# EAGLE design TSOC_Teensy3X (EAGLE 6.6.0)
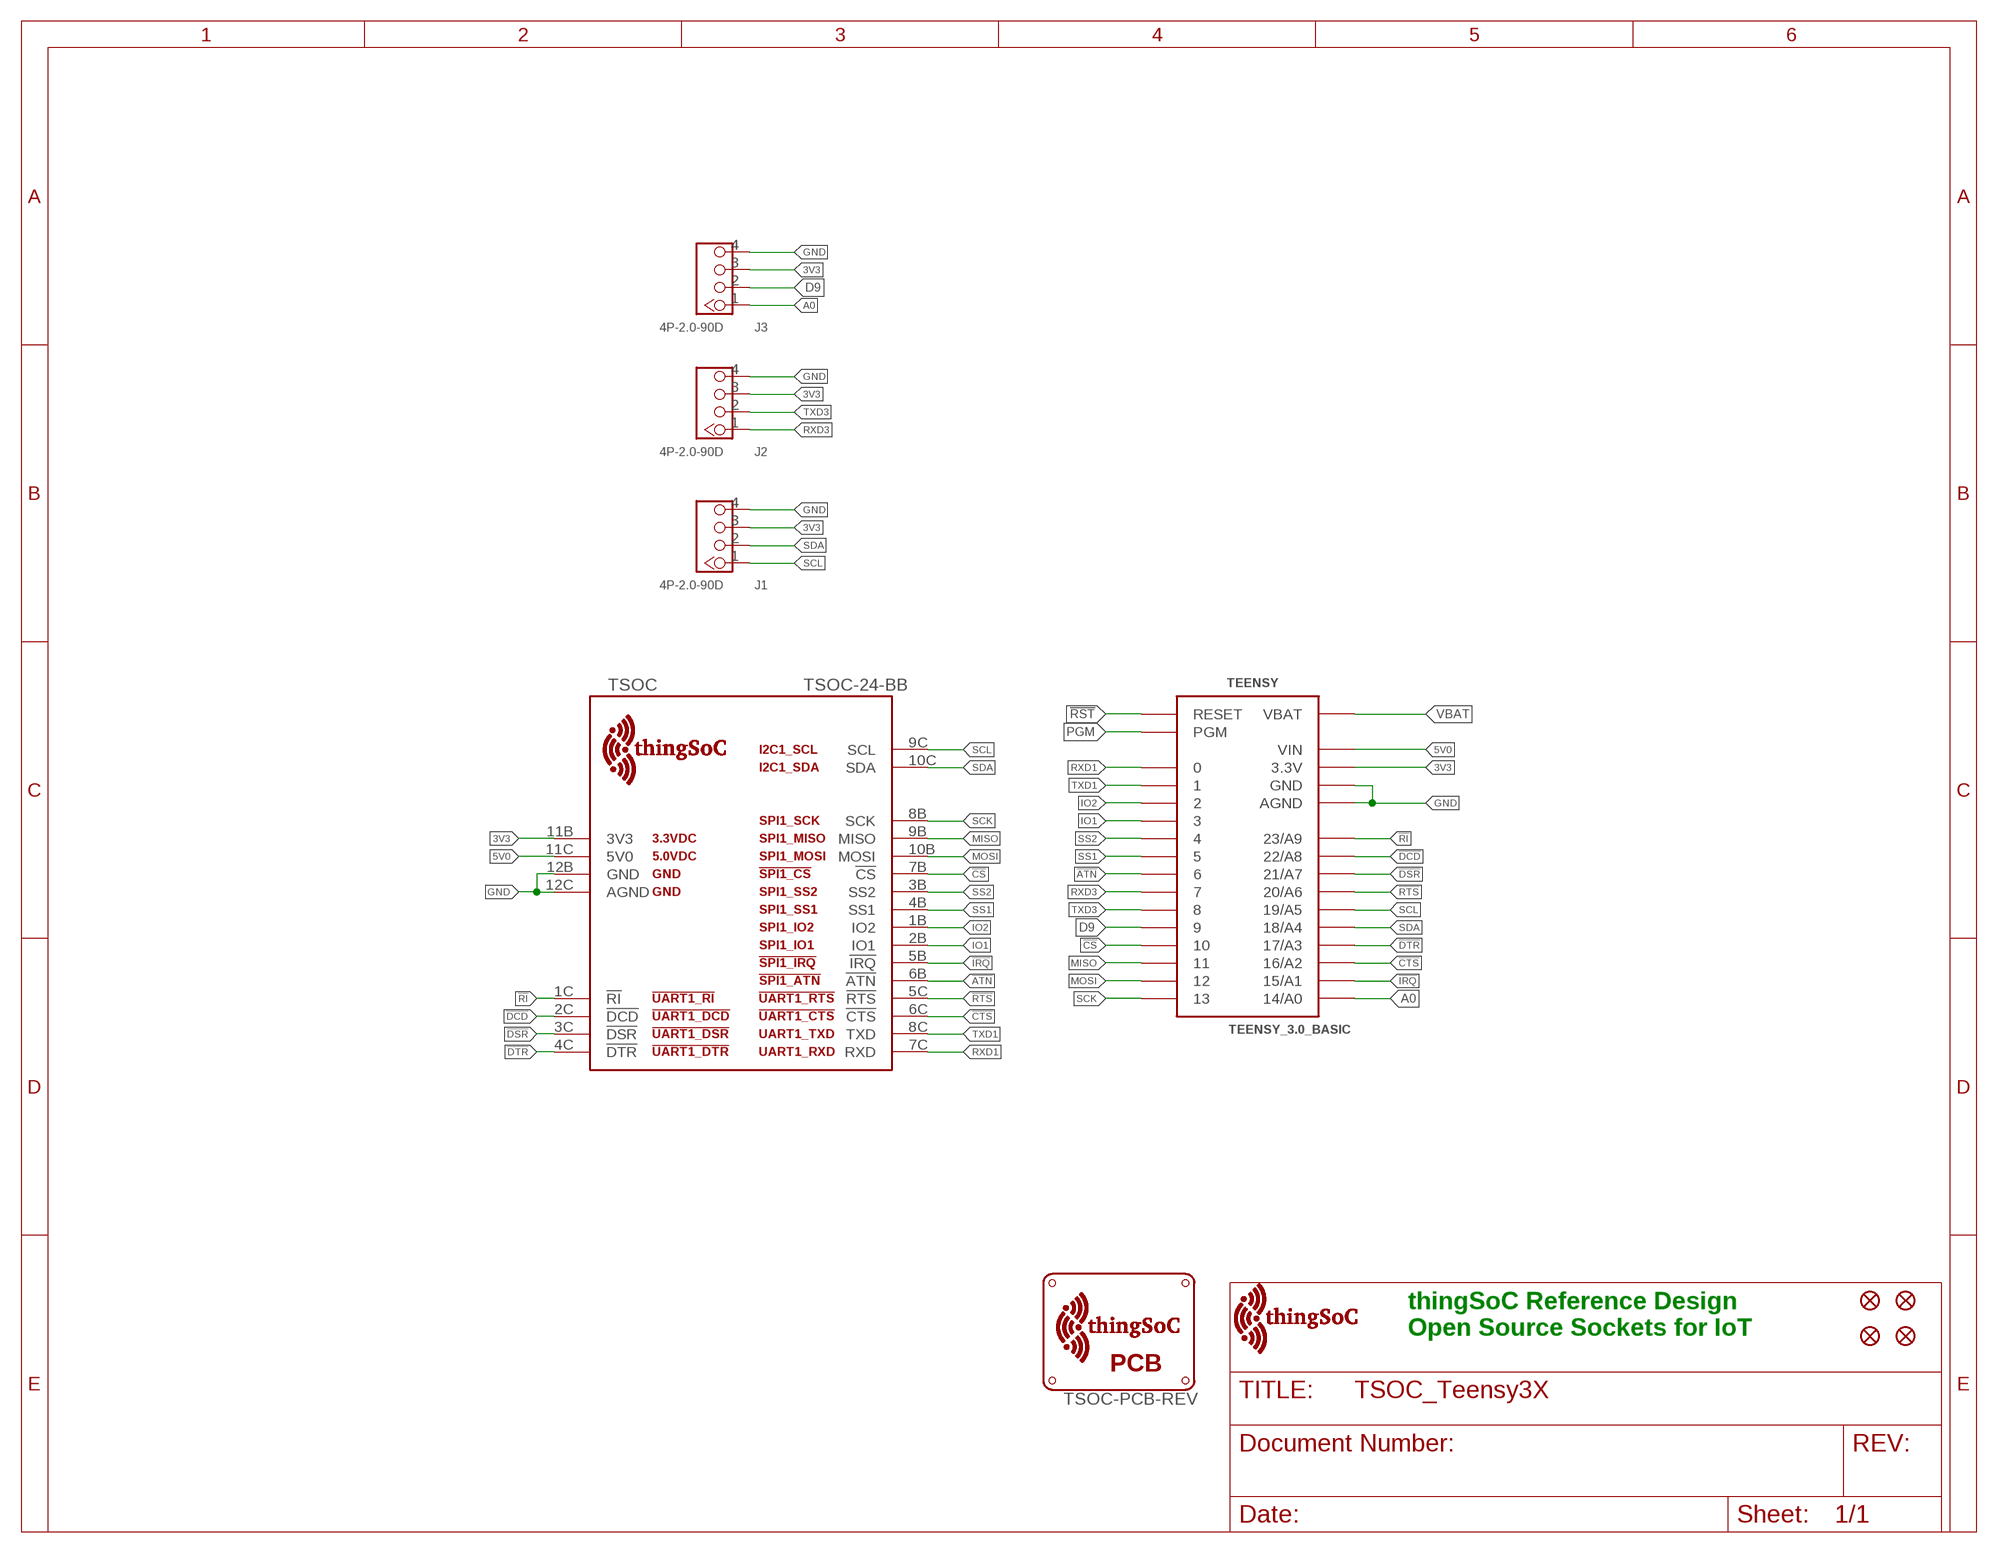
[diagram p0: schematic, sheet 1]

## Parts
FID1  FIDUCIALUFIDUCIAL  [MICRO-FIDUCIAL]
FID2  FIDUCIALUFIDUCIAL  [MICRO-FIDUCIAL]
FID3  FIDUCIALUFIDUCIAL  [MICRO-FIDUCIAL]
FID4  FIDUCIALUFIDUCIAL  [MICRO-FIDUCIAL]
J1  4P-2.0-90D  GROVE-CONNECTOR-DIP-90D(4P-2.0)  [HW4-2.0-90D]
J2  4P-2.0-90D  GROVE-CONNECTOR-DIP-90D(4P-2.0)  [HW4-2.0-90D]
J3  4P-2.0-90D  GROVE-CONNECTOR-DIP-90D(4P-2.0)  [HW4-2.0-90D]
TEENSY  TEENSY_3.0_BASIC  [TEENSY_3.0_BASIC]
TSOC  TSOC-24-BB  [TSOC-BB-S24]
U$2  TSOC-PCB-REV  [TSOC-BB-BRD-PLUS-CUT-REV]
U$5  TSOC-LOGO-LRG  [TSOC-LOGO-LRG]

## Nets
3V3: J1.3 J2.3 J3.3 TEENSY.3.3V TEENSY.3.3V1(3.3V) TSOC.11B(3V3)
5V0: TEENSY.VIN TSOC.11C(5V0)
!ATN: TEENSY.6 TSOC.6B(!ATN)
!CS: TEENSY.10 TSOC.7B(!CS)
!CTS: TEENSY.16/A2 TSOC.6C(!CTS)
!DCD: TEENSY.22/A8 TSOC.2C(!DCD)
!DSR: TEENSY.21/A7 TSOC.3C(!DSR)
!DTR: TEENSY.17/A3 TSOC.4C(!DTR)
!IRQ: TEENSY.15/A1 TSOC.5B(!IRQ)
!RI: TEENSY.23/A9 TSOC.1C(!RI)
!RST: TEENSY.RESET
!RTS: TEENSY.20/A6 TSOC.5C(!RTS)
A0: J3.1 TEENSY.14/A0
D9: J3.2 TEENSY.9
GND: J1.4 J2.4 J3.4 TEENSY.AGND TEENSY.GND TEENSY.GND1(GND) TSOC.12B(GND) TSOC.12C(AGND)
IO1: TEENSY.3 TSOC.2B(IO1)
IO2: TEENSY.2 TSOC.1B(IO2)
MISO: TEENSY.11 TSOC.9B(MISO)
MOSI: TEENSY.12 TSOC.10B(MOSI)
PGM: TEENSY.PGM
RXD1: TEENSY.0 TSOC.7C(RXD)
RXD3: J2.1 TEENSY.7
SCK: TEENSY.13 TSOC.8B(SCK)
SCL: J1.1 TEENSY.19/A5 TSOC.9C(SCL)
SDA: J1.2 TEENSY.18/A4 TSOC.10C(SDA)
SS1: TEENSY.5 TSOC.4B(SS1)
SS2: TEENSY.4 TSOC.3B(SS2)
TXD1: TEENSY.1 TSOC.8C(TXD)
TXD3: J2.2 TEENSY.8
VBAT: TEENSY.VBAT

## Notes on the sheet
- thingSoC Reference Design
  Open Source Sockets for IoT

## Library data of the parts
FID1-FID4 = TSOC-ESP8266-BASE:FIDUCIAL: Fiducial Alignment Points Various fiducial points for machine vision alignment.
J1-J3 = Seeed-Connector -2016:GROVE-CONNECTOR-DIP-90D(4P-2.0): 320110034
TEENSY = Teensy3.0:TEENSY_3.0_BASIC: Basic Teensy 3.0 with none of the 'inner' pins enabled. See '+4', 'AllAnalogPins", and 'AllPins' packages for additional pin holes, as needed.
TSOC = thingSoC:TSOC-24: thingSoC Twenty-Four(24) Pin Socket Source LBR : http://www.thingsoc.com Github : https://github.com/thingsoc License : http://creativecommons.org/licenses/by-sa/4.0/ (Creative Commons 4.0) THIS SOFTWARE IS PROVIDED BY THE CONTRIBUTORS "AS IS" AND WITHOUT ANY EXPRESS OR IMPLIED WARRANTIES, INCLUDING, BUT NOT LIMITED TO, THE IMPLIED WARRANTIES OF MERCHANTABILITY AND FITNESS FOR A PARTICULAR PURPOSE ARE DISCLAIMED. IN NO EVENT SHALL THE COPYRIGHT OWNER OR CONTRIBUTORS BE LIABLE FOR ANY DIRECT, INDIRECT, INCIDENTAL, SPECIAL, EXEMPLARY, OR CONSEQUENTIAL DAMAGES (INCLUDING, BUT NOT LIMITED TO, PROCUREMENT OF SUBSTITUTE GOODS OR SERVICES; LOSS OF USE, DATA, OR PROFITS; OR BUSINESS INTERRUPTION) HOWEVER CAUSED AND ON ANY THEORY OF LIABILITY, WHETHER IN CONTRACT, STRICT LIABILITY, OR TORT (INCLUDING NEGLIGENCE OR OTHERWISE) ARISING IN ANY WAY OUT OF THE USE OF THIS SOFTWARE, EVEN IF ADVISED OF THE POSSIBILITY OF SUCH DAMAGE.
U$2 = thingSoC:TSOC-PCB: thingSoC PCB Outlines Boards Outlines for Standard Sizes (in the DImension Layer) (Registration marks in the tDocu layer - make sure to turn on tDocu/bDocu) Source LBR : http://www.thingsoc.com Github : https://github.com/thingsoc License : http://creativecommons.org/licenses/by-sa/4.0/ (Creative Commons 4.0) THIS SOFTWARE IS PROVIDED BY THE CONTRIBUTORS "AS IS" AND WITHOUT ANY EXPRESS OR IMPLIED WARRANTIES, INCLUDING, BUT NOT LIMITED TO, THE IMPLIED WARRANTIES OF MERCHANTABILITY AND FITNESS FOR A PARTICULAR PURPOSE ARE DISCLAIMED. IN NO EVENT SHALL THE COPYRIGHT OWNER OR CONTRIBUTORS BE LIABLE FOR ANY DIRECT, INDIRECT, INCIDENTAL, SPECIAL, EXEMPLARY, OR CONSEQUENTIAL DAMAGES (INCLUDING, BUT NOT LIMITED TO, PROCUREMENT OF SUBSTITUTE GOODS OR SERVICES; LOSS OF USE, DATA, OR PROFITS; OR BUSINESS INTERRUPTION) HOWEVER CAUSED AND ON ANY THEORY OF LIABILITY, WHETHER IN CONTRACT, STRICT LIABILITY, OR TORT (INCLUDING NEGLIGENCE OR OTHERWISE) ARISING IN ANY WAY OUT OF THE USE OF THIS SOFTWARE, EVEN IF ADVISED OF THE POSSIBILITY OF SUCH DAMAGE.
U$5 = thingSoC:TSOC-LOGO: thingSoC Logo Source LBR : http://www.thingsoc.com Github : https://github.com/thingsoc License : http://creativecommons.org/licenses/by-sa/4.0/ (Creative Commons 4.0) THIS SOFTWARE IS PROVIDED BY THE CONTRIBUTORS "AS IS" AND WITHOUT ANY EXPRESS OR IMPLIED WARRANTIES, INCLUDING, BUT NOT LIMITED TO, THE IMPLIED WARRANTIES OF MERCHANTABILITY AND FITNESS FOR A PARTICULAR PURPOSE ARE DISCLAIMED. IN NO EVENT SHALL THE COPYRIGHT OWNER OR CONTRIBUTORS BE LIABLE FOR ANY DIRECT, INDIRECT, INCIDENTAL, SPECIAL, EXEMPLARY, OR CONSEQUENTIAL DAMAGES (INCLUDING, BUT NOT LIMITED TO, PROCUREMENT OF SUBSTITUTE GOODS OR SERVICES; LOSS OF USE, DATA, OR PROFITS; OR BUSINESS INTERRUPTION) HOWEVER CAUSED AND ON ANY THEORY OF LIABILITY, WHETHER IN CONTRACT, STRICT LIABILITY, OR TORT (INCLUDING NEGLIGENCE OR OTHERWISE) ARISING IN ANY WAY OUT OF THE USE OF THIS SOFTWARE, EVEN IF ADVISED OF THE POSSIBILITY OF SUCH DAMAGE.

## Net classes
1 vcc: width 0.254 mm

## Board
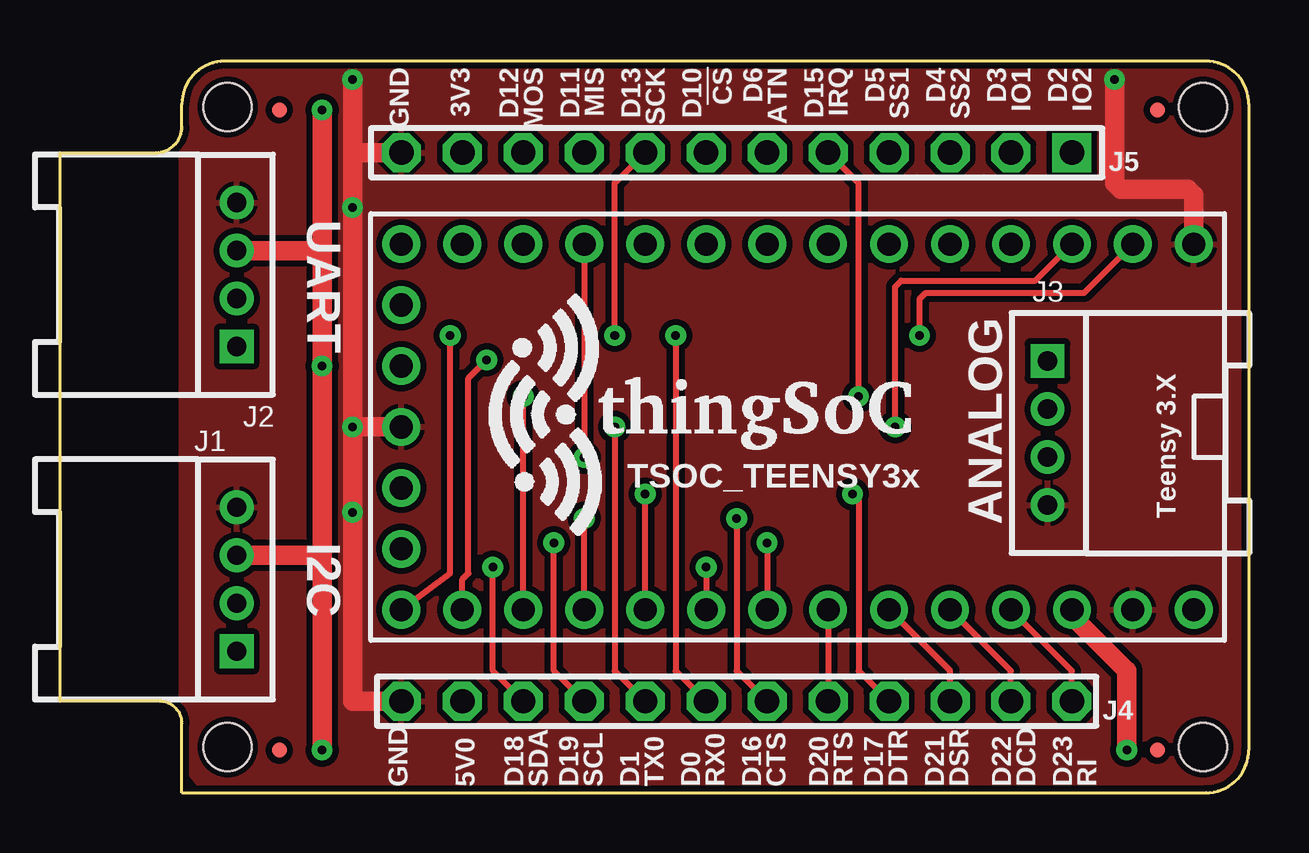
[diagram p1: board, top side]
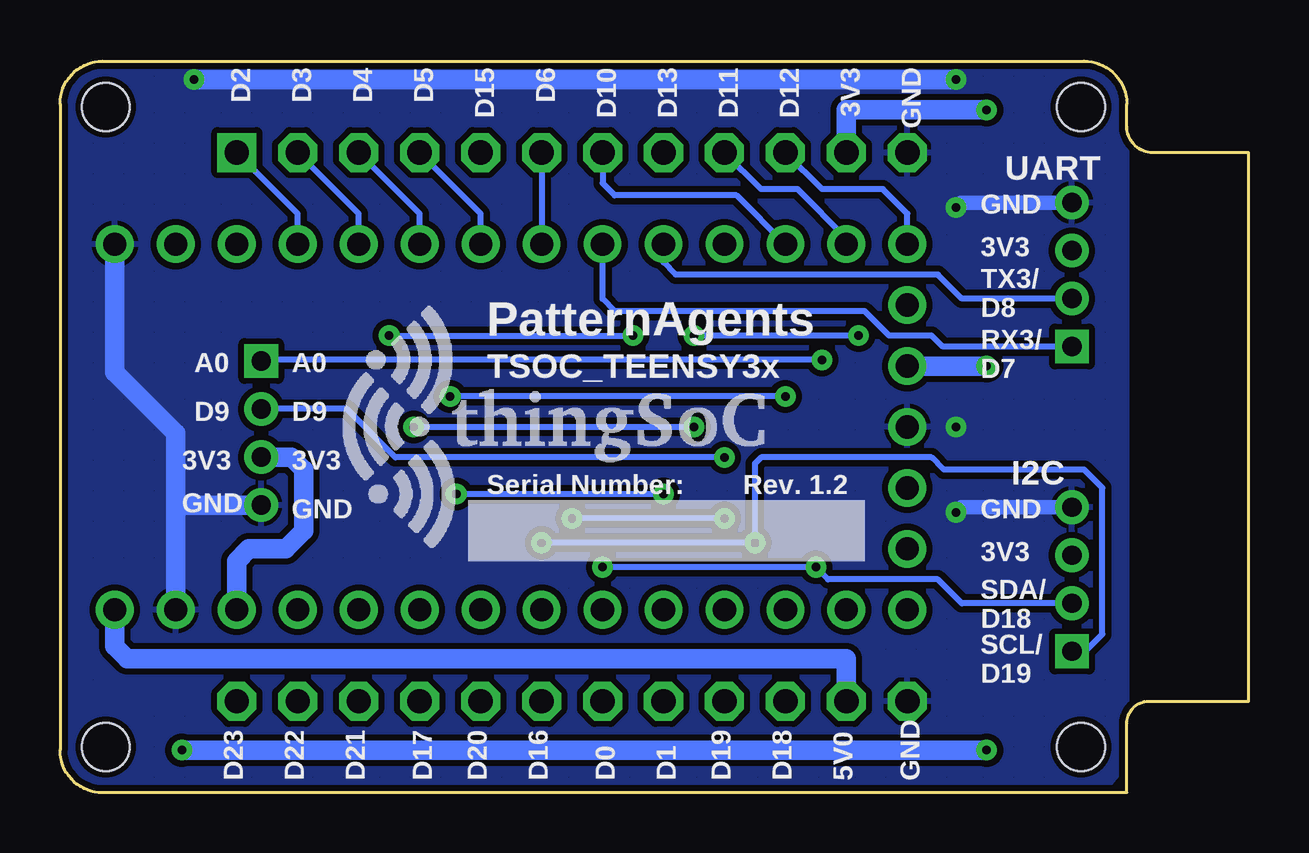
[diagram p2: board, bottom side, seen from below]

Size 49.53 x 30.48 mm. Coordinates in mm from the lower left corner, seen from the top.
Copper layers (1*16): Top 0.035mm / dielectric 1.5mm / Bottom 0.035mm
Design rules "PatternAgents_7mil": minimum track width 7mil, minimum drill 14mil, track to track 7mil, track to pad 7mil, pad to pad 7mil, via to via 7mil, smd to smd 7mil, copper to edge 7mil, drill to drill 7mil, minimum pad ring 12mil, minimum via ring 10mil, stop-mask expansion 4mil, vias tented up to drill 25mil, thermal gap 7mil

### Footprints (pad centres in the part's own frame; a part is rotated, then mirrored left to right if it is on the bottom)
MICRO-FIDUCIAL = smd 0.635 x 0.635: 1 0,0
HW4-2.0-90D = drill 0.8 pad 1.27 square: 1 -3,0 | drill 0.8 pad 1.27: 2 -1,0; 3 1,0; 4 3,0
TEENSY_3.0_BASIC = drill 0.965: 0 -7.62,13.97; 1 -7.62,11.43; 2 -7.62,8.89; 3 -7.62,6.35; 3.3V 7.62,11.43; 3.3V1 -2.54,-16.51; 4 -7.62,3.81; 5 -7.62,1.27; 6 -7.62,-1.27; 7 -7.62,-3.81; 8 -7.62,-6.35; 9 -7.62,-8.89; 10 -7.62,-11.43; 11 -7.62,-13.97; 12 -7.62,-16.51; 13 7.62,-16.51; 14/A0 7.62,-13.97; 15/A1 7.62,-11.43; 16/A2 7.62,-8.89; 17/A3 7.62,-6.35; 18/A4 7.62,-3.81; 19/A5 7.62,-1.27; 20/A6 7.62,1.27; 21/A7 7.62,3.81; 22/A8 7.62,6.35; 23/A9 7.62,8.89; AGND 7.62,13.97; GND -7.62,16.51; GND1 0,-16.51; PGM 2.54,-16.51; RESET 5.08,-16.51; VBAT -5.08,-16.51; VIN 7.62,16.51
TSOC-BB-S24 = drill 1.016 square: 1B -11.43,11.43 | drill 1.016 octagon: 1C 11.43,11.43; 2B -11.43,8.89; 2C 11.43,8.89; 3B -11.43,6.35; 3C 11.43,6.35; 4B -11.43,3.81; 4C 11.43,3.81; 5B -11.43,1.27; 5C 11.43,1.27; 6B -11.43,-1.27; 6C 11.43,-1.27; 7B -11.43,-3.81; 7C 11.43,-3.81; 8B -11.43,-6.35; 8C 11.43,-6.35; 9B -11.43,-8.89; 9C 11.43,-8.89; 10B -11.43,-11.43; 10C 11.43,-11.43; 11B -11.43,-13.97; 11C 11.43,-13.97; 12B -11.43,-16.51; 12C 11.43,-16.51
TSOC-BB-BRD-PLUS-CUT-REV = hole 2: -13.335,-23.749; 13.335,-23.749; -13.335,16.891; 13.335,16.891

### Placement (x,y rotation side)
FID1  9.14,1.78 0 top
FID2  45.72,1.78 0 top
FID3  9.14,28.45 0 top
FID4  45.72,28.45 0 top
J1  7.37,8.89 90 top
J2  7.37,21.59 90 top
J3  41.15,14.99 270 top
TEENSY  30.73,15.24 270 top
TSOC  30.73,15.24 270 top
U$1  TSOC-LOGO-LRG  [TSOC-LOGO-LRG]  34.54,15.24 0 bottom
U$2  30.73,15.24 270 top
U$5  21.08,15.75 0 top

### Tracks (layer width: path | path; a pad name or v marks a point on that pad's centre or on a via)
3V3  (via drill 0.36)
  Top 0.61: 10.91,9.89 10.92,9.91 | 10.91,22.59 10.92,22.61
  Top 0.813: v10.92,28.45 10.92,22.61 v10.92,17.78 10.92,9.91 v10.92,1.78 | J1.3 10.91,9.89 | J2.3 10.91,22.59 | TEENSY.3.3V 42.16,7.37 44.45,5.08 v44.45,1.78
  Bottom 0.813: TSOC.11B 16.76,28.45 v10.92,28.45 | v10.92,1.78 v44.45,1.78 | TEENSY.3.3V1 v10.92,17.78 | J3.3 39.89,13.99 39.37,13.46 39.37,10.92 40.13,10.16 41.66,10.16 42.16,9.65 TEENSY.3.3V
5V0
  Bottom 0.813: TSOC.11C 16.76,5.59 46.74,5.59 47.24,6.1 TEENSY.VIN
!ATN
  Bottom 0.254: TSOC.6B TEENSY.6
!CS
  Bottom 0.254: TEENSY.10 21.34,24.89 26.42,24.89 26.92,25.4 TSOC.7B
!CTS  (via drill 0.36)
  Top 0.254: TEENSY.16/A2 v21.84,11.43 | v28.19,11.43 28.19,5.08 TSOC.6C
  Bottom 0.254: v21.84,11.43 v28.19,11.43
!DCD
  Top 0.254: TSOC.2C 39.62,5.08 TEENSY.22/A8
!DSR
  Top 0.254: TSOC.3C 37.08,5.08 TEENSY.21/A7
!DTR  (via drill 0.36)
  Top 0.254: TEENSY.17/A3 v24.38,12.45 | v33.02,12.45 33.27,12.19 33.27,5.08 TSOC.4C
  Bottom 0.254: v24.38,12.45 v33.02,12.45
!IRQ  (via drill 0.36)
  Top 0.254: TEENSY.15/A1 v19.3,16.51 | v33.27,16.51 33.27,25.4 TSOC.5B
  Bottom 0.254: v19.3,16.51 v33.27,16.51
!RI
  Top 0.254: TSOC.1C 42.16,5.08 TEENSY.23/A9
!RTS
  Top 0.254: TEENSY.20/A6 TSOC.5C
A0  (via drill 0.36)
  Top 0.254: TEENSY.14/A0 16.76,8.89 17.02,9.14 17.02,17.27 v17.78,18.03
  Bottom 0.254: v17.78,18.03 41.1,18.03 J3.1
D9  (via drill 0.36)
  Top 0.254: TEENSY.9 v21.84,13.97
  Bottom 0.254: v21.84,13.97 35.56,13.97 37.59,16 41.13,16 J3.2
GND  (via drill 0.36)
  Top 0.813: TEENSY.GND1 v12.19,15.24 | v12.19,15.24 v12.19,11.68 12.19,3.81 TSOC.12C | v12.19,29.72 12.19,26.67 | v12.19,15.24 v12.19,24.38 12.19,26.67 | TSOC.12B 12.19,26.67 | TEENSY.GND 47.24,24.89 46.99,25.15 44.2,25.15 43.94,25.4 v43.94,29.72
  Bottom 0.61: J1.4 11.99,11.89 v12.19,11.68 | J2.4 11.99,24.59 v12.19,24.38
  Bottom 0.813: v12.19,29.72 v43.94,29.72 | TEENSY.AGND 44.7,11.94 | 44.7,11.94 44.7,14.99 47.24,17.53 TEENSY.GND | J3.4 44.66,11.99 44.7,11.94
  pour Top (isolate 0.254, hatched): 6.1,0 5.08,1.27 5.08,29.21 6.1,30.48 48.26,30.48 49.53,29.21 49.53,1.52 48.01,0
  pour Bottom (isolate 0.254, hatched): 6.1,0 5.08,1.27 5.08,29.21 6.1,30.48 48.26,30.48 49.53,29.21 49.53,1.52 48.01,0
IO1
  Bottom 0.254: TEENSY.3 37.08,24.13 TSOC.2B
IO2
  Bottom 0.254: TEENSY.2 39.62,24.13 TSOC.1B
MISO
  Bottom 0.254: TEENSY.11 16.76,23.11 18.8,25.15 20.32,25.15 TSOC.9B
MOSI
  Bottom 0.254: TEENSY.12 14.22,24.13 15.24,25.15 17.78,25.15 TSOC.10B
RXD1  (via drill 0.36)
  Top 0.254: v25.65,19.05 25.65,5.08 TSOC.7C | v35.81,19.05 35.81,20.57 36.07,20.83 42.67,20.83 TEENSY.0
  Bottom 0.254: v35.81,19.05 v25.65,19.05
RXD3
  Bottom 0.254: J2.1 12.75,18.59 13.21,19.05 14.99,19.05 16,20.07 26.42,20.07 26.92,20.57 TEENSY.7
SCK  (via drill 0.36)
  Top 0.254: v23.11,19.05 23.11,25.4 TSOC.8B | TEENSY.13 16.26,9.14 v16.26,19.05
  Bottom 0.254: v16.26,19.05 v23.11,19.05
SCL  (via drill 0.36)
  Top 0.254: TSOC.9C 20.57,5.08 v20.57,10.41 | v29.46,10.41 TEENSY.19/A5
  Bottom 0.254: v29.46,10.41 v20.57,10.41 20.57,13.72 20.32,13.97 13.21,13.97 12.7,13.46 6.86,13.46 6.1,12.7 6.1,6.6 6.81,5.89 J1.1
SDA  (via drill 0.36)
  Top 0.254: TSOC.10C 18.03,5.08 v18.03,9.4 | v26.92,9.4 TEENSY.18/A4
  Bottom 0.254: v26.92,9.4 v18.03,9.4 17.53,8.89 12.95,8.89 11.95,7.89 J1.2
SS1
  Bottom 0.254: TEENSY.5 32,24.13 TSOC.4B
SS2
  Bottom 0.254: TEENSY.4 34.54,24.13 TSOC.3B
TXD1  (via drill 0.36)
  Top 0.254: v23.11,15.24 23.11,5.08 TSOC.8C | v34.8,15.24 34.8,21.08 35.05,21.34 40.64,21.34 TEENSY.1
  Bottom 0.254: v34.8,15.24 v23.11,15.24
TXD3
  Bottom 0.254: J2.2 11.95,20.59 12.95,21.59 23.88,21.59 24.38,22.1 TEENSY.8

### Text on the board
tPlace: GND | 3V3 | D12 | MOS | D11 | MIS | D13 | SCK | D10 | !CS | D6 | ATN | D15 | IRQ | D5 | SS1 | D4 | SS2 | D3 | IO1 | D2 | IO2 | J5 | UART | TSOC_TEENSY3x | ANALOG | Teensy 3.X | I2C | J4 | GND | 5V0 | D18 | SDA | D19 | SCL | D1 | TX0 | D0 | RX0 | D16 | CTS | D20 | RTS | D17 | DTR | D21 | DSR | D22 | DCD | D23 | RI
bPlace: GND | 3V3 | D12 | D11 | D13 | D10 | D6 | D15 | D5 | D4 | D3 | D2 | UART | GND | 3V3 | TX3/ / D8 | PatternAgents | A0 | A0 | RX3/ / D7 | TSOC_TEENSY3x | D9 | D9 | I2C | 3V3 | 3V3 | Rev. 1.2 | Serial Number: | GND | GND | GND | 3V3 | SDA/ / D18 | SCL/ / D19 | GND | 5V0 | D18 | D19 | D1 | D0 | D16 | D20 | D17 | D21 | D22 | D23